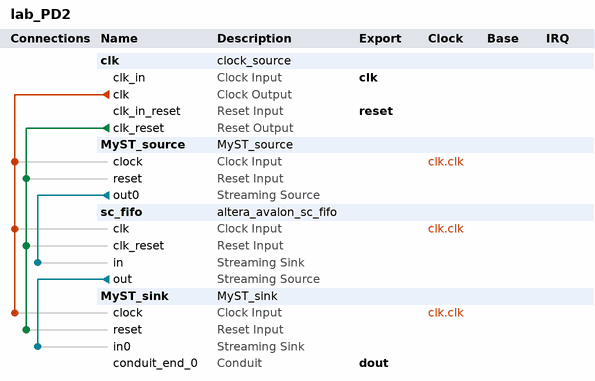
[diagram p0: system contents]
# Platform Designer (Qsys) system lab_PD2, Cyclone IV E EP4CE10E22A7
# Parameters at their usual value, and those the tool derives, are not listed.
package require -exact qsys 18.1
create_system lab_PD2
set_project_property DEVICE_FAMILY {Cyclone IV E}
set_project_property DEVICE EP4CE10E22A7

add_instance clk clock_source 18.1
set_instance_parameter_value clk clockFrequency 50000000
set_instance_parameter_value clk resetSynchronousEdges DEASSERT

add_instance MyST_source MyST_source 1.0

add_instance sc_fifo altera_avalon_sc_fifo 18.1
set_instance_parameter_value sc_fifo BITS_PER_SYMBOL 4
set_instance_parameter_value sc_fifo CHANNEL_WIDTH 0
set_instance_parameter_value sc_fifo ERROR_WIDTH 0
set_instance_parameter_value sc_fifo FIFO_DEPTH 16
set_instance_parameter_value sc_fifo USE_FILL_LEVEL 0
set_instance_parameter_value sc_fifo USE_MEMORY_BLOCKS 1
set_instance_parameter_value sc_fifo USE_STORE_FORWARD 0

add_instance MyST_sink MyST_sink 1.0

# connections
add_connection clk.clk MyST_sink.clock clock
add_connection clk.clk MyST_source.clock clock
add_connection clk.clk sc_fifo.clk clock
add_connection clk.clk_reset MyST_sink.reset reset
add_connection clk.clk_reset MyST_source.reset reset
add_connection clk.clk_reset sc_fifo.clk_reset reset
add_connection MyST_source.out0 sc_fifo.in avalon_streaming
add_connection sc_fifo.out MyST_sink.in0 avalon_streaming

# exported interfaces
add_interface clk clock sink
set_interface_property clk EXPORT_OF clk.clk_in
add_interface dout conduit end
set_interface_property dout EXPORT_OF MyST_sink.conduit_end_0
add_interface reset reset sink
set_interface_property reset EXPORT_OF clk.clk_in_reset

set_interconnect_requirement {$system} qsys_mm.clockCrossingAdapter HANDSHAKE
set_interconnect_requirement {$system} qsys_mm.enableEccProtection FALSE
set_interconnect_requirement {$system} qsys_mm.insertDefaultSlave FALSE
set_interconnect_requirement {$system} qsys_mm.maxAdditionalLatency 1

save_system lab_PD2.qsys
